# Altium project DAQBOXRev12025.PrjPcb
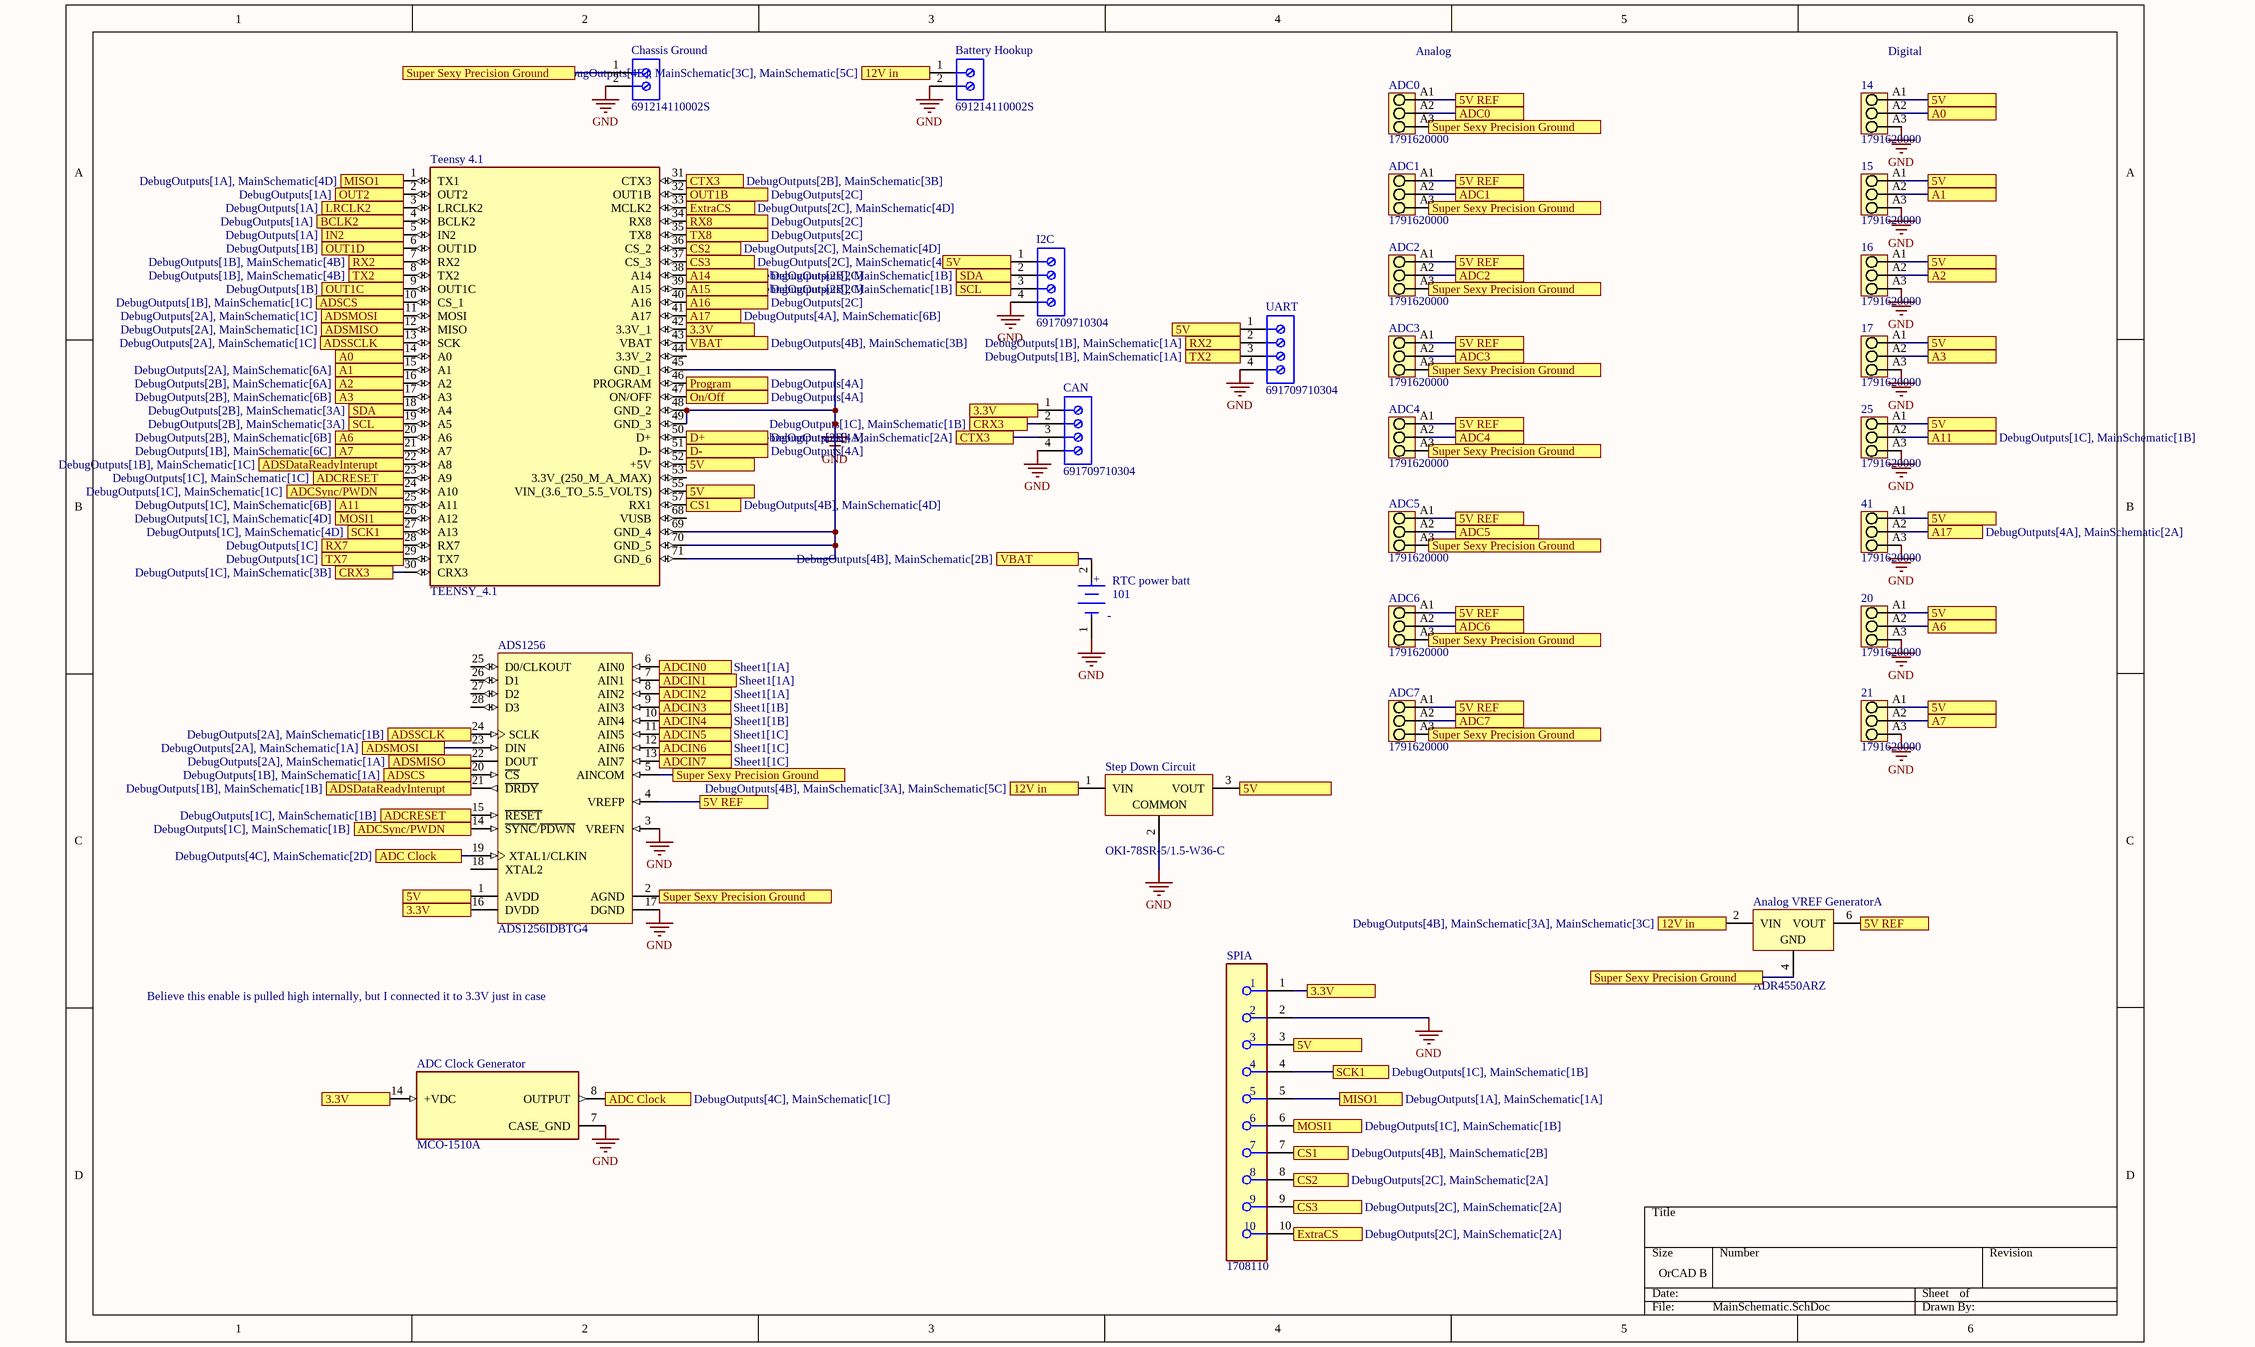
[diagram p0: MainSchematic.SchDoc]
3 sheets, 50 parts. Net scope: flat (ports and power ports of the same name join across sheets).
Board file: PCB2.PcbDoc
Sheets:
  MainSchematic.SchDoc
  DebugOutputs.SchDoc
  Sheet1.SchDoc

## Sheet MainSchematic.SchDoc
size OrCAD B; SheetNumber: 1; SheetTotal: 3

### Parts
14  1791620000  [PM_5_00_90_03]
15  1791620000  [PM_5_00_90_03]
16  1791620000  [PM_5_00_90_03]
17  1791620000  [PM_5_00_90_03]
20  1791620000  [PM_5_00_90_03]
21  1791620000  [PM_5_00_90_03]
25  1791620000  [PM_5_00_90_03]
41  1791620000  [PM_5_00_90_03]
ADC0  1791620000  [PM_5_00_90_03]
ADC1  1791620000  [PM_5_00_90_03]
ADC2  1791620000  [PM_5_00_90_03]
ADC3  1791620000  [PM_5_00_90_03]
ADC4  1791620000  [PM_5_00_90_03]
ADC5  1791620000  [PM_5_00_90_03]
ADC6  1791620000  [PM_5_00_90_03]
ADC7  1791620000  [PM_5_00_90_03]
ADC_Clock_Generator  MCO-1510A  [OSC_ECS-100AX-500]
ADS1256  ADS1256IDBTG4  [TI-DB28_L]
Analog_VREF_Generator  ADR4550ARZ  [ADI-R-8_N]  (part A of 2)
Battery_Hookup  691214110002S  [691214110002S]
CAN  691709710304  [691709710304]
Chassis_Ground  691214110002S  [691214110002S]
I2C  691709710304  [691709710304]
RTC_power_batt  101  [FP-101-MFG]
SPI  1708110  [FP-1708110-MFG]  (part A of 2)
Step_Down_Circuit  OKI-78SR-5/1.5-W36-C  [MURA-OKI-78SR-3]
Teensy_4.1  TEENSY_4.1  [TEENSY41]
UART  691709710304  [691709710304]

### Ports
3.3V (see DebugOutputs[4B], MainSchematic[1C], MainSchematic[1D], MainSchematic[2A], MainSchematic[3B]), 3.3V (see DebugOutputs[4B], MainSchematic[1C], MainSchematic[1D], MainSchematic[2A], MainSchematic[4C]), 3.3V (see DebugOutputs[4B], MainSchematic[1C], MainSchematic[1D], MainSchematic[3B], MainSchematic[4C]), 3.3V (see DebugOutputs[4B], MainSchematic[1C], MainSchematic[2A], MainSchematic[3B], MainSchematic[4C]), 3.3V (see DebugOutputs[4B], MainSchematic[1D], MainSchematic[2A], MainSchematic[3B], MainSchematic[4C]), 5V (see DebugOutputs[4B], MainSchematic[1C], MainSchematic[2B], MainSchematic[3A], MainSchematic[4A], MainSchematic[4C], MainSchematic[4D], MainSchematic[6A], MainSchematic[6B]), 5V (see DebugOutputs[4B], MainSchematic[1C], MainSchematic[2B], MainSchematic[3A], MainSchematic[4A], MainSchematic[4C], MainSchematic[4D], MainSchematic[6A], MainSchematic[6B], MainSchematic[6C]), 5V (see DebugOutputs[4B], MainSchematic[1C], MainSchematic[2B], MainSchematic[3A], MainSchematic[4A], MainSchematic[4C], MainSchematic[6A], MainSchematic[6B], MainSchematic[6C]), 5V (see DebugOutputs[4B], MainSchematic[1C], MainSchematic[2B], MainSchematic[3A], MainSchematic[4A], MainSchematic[4D], MainSchematic[6A], MainSchematic[6B], MainSchematic[6C]), 5V (see DebugOutputs[4B], MainSchematic[1C], MainSchematic[2B], MainSchematic[3A], MainSchematic[4C], MainSchematic[4D], MainSchematic[6A], MainSchematic[6B], MainSchematic[6C]), 5V (see DebugOutputs[4B], MainSchematic[1C], MainSchematic[2B], MainSchematic[4A], MainSchematic[4C], MainSchematic[4D], MainSchematic[6A], MainSchematic[6B], MainSchematic[6C]), 5V (see DebugOutputs[4B], MainSchematic[2B], MainSchematic[3A], MainSchematic[4A], MainSchematic[4C], MainSchematic[4D], MainSchematic[6A], MainSchematic[6B], MainSchematic[6C]), 5V REF (see DebugOutputs[4B], MainSchematic[2C], MainSchematic[5A], MainSchematic[5B], MainSchematic[5C]), 5V REF (see DebugOutputs[4B], MainSchematic[2C], MainSchematic[5A], MainSchematic[5B], MainSchematic[5C], MainSchematic[6C]), 5V REF (see DebugOutputs[4B], MainSchematic[2C], MainSchematic[5A], MainSchematic[5B], MainSchematic[6C]), 5V REF (see DebugOutputs[4B], MainSchematic[5A], MainSchematic[5B], MainSchematic[5C], MainSchematic[6C]), 12V in (see DebugOutputs[4B], MainSchematic[3A], MainSchematic[3C]), 12V in (see DebugOutputs[4B], MainSchematic[3A], MainSchematic[5C]), 12V in (see DebugOutputs[4B], MainSchematic[3C], MainSchematic[5C]), A0 (see DebugOutputs[2A], MainSchematic[1B]), A0 (see DebugOutputs[2A], MainSchematic[6A]), A1 (see DebugOutputs[2A], MainSchematic[1B]), A1 (see DebugOutputs[2A], MainSchematic[6A]), A2 (see DebugOutputs[2B], MainSchematic[1B]), A2 (see DebugOutputs[2B], MainSchematic[6A]), A3 (see DebugOutputs[2B], MainSchematic[1B]), A3 (see DebugOutputs[2B], MainSchematic[6B]), A6 (see DebugOutputs[2B], MainSchematic[1B]), A6 (see DebugOutputs[2B], MainSchematic[6B]), A7 (see DebugOutputs[1B], MainSchematic[1B]), A7 (see DebugOutputs[1B], MainSchematic[6C]), A11 (see DebugOutputs[1C], MainSchematic[1B]), A11 (see DebugOutputs[1C], MainSchematic[6B]), A14 (see DebugOutputs[2C]), A15 (see DebugOutputs[2C]), A16 (see DebugOutputs[2C]), A17 (see DebugOutputs[4A], MainSchematic[2A]), A17 (see DebugOutputs[4A], MainSchematic[6B]), ADC0 (see DebugOutputs[4C], Sheet1[2A]), ADC1 (see DebugOutputs[4C], Sheet1[2A]), ADC2 (see DebugOutputs[4C], Sheet1[2A]), ADC3 (see DebugOutputs[4C], Sheet1[2B]), ADC4 (see DebugOutputs[4C], Sheet1[2B]), ADC5 (see DebugOutputs[4C], Sheet1[2C]), ADC6 (see DebugOutputs[4C], Sheet1[2C]), ADC7 (see DebugOutputs[4C], Sheet1[2C]), ADC Clock (see DebugOutputs[4C], MainSchematic[1C]), ADC Clock (see DebugOutputs[4C], MainSchematic[2D]), ADCIN0 (see Sheet1[1A]), ADCIN1 (see Sheet1[1A]), ADCIN2 (see Sheet1[1A]), ADCIN3 (see Sheet1[1B]), ADCIN4 (see Sheet1[1B]), ADCIN5 (see Sheet1[1C]), ADCIN6 (see Sheet1[1C]), ADCIN7 (see Sheet1[1C]), ADCRESET (see DebugOutputs[1C], MainSchematic[1B]), ADCRESET (see DebugOutputs[1C], MainSchematic[1C]), ADCSync/PWDN (see DebugOutputs[1C], MainSchematic[1B]), ADCSync/PWDN (see DebugOutputs[1C], MainSchematic[1C]), ADSCS (see DebugOutputs[1B], MainSchematic[1A]), ADSCS (see DebugOutputs[1B], MainSchematic[1C]), ADSDataReadyInterupt (see DebugOutputs[1B], MainSchematic[1B]), ADSDataReadyInterupt (see DebugOutputs[1B], MainSchematic[1C]), ADSMISO (see DebugOutputs[2A], MainSchematic[1A]), ADSMISO (see DebugOutputs[2A], MainSchematic[1C]), ADSMOSI (see DebugOutputs[2A], MainSchematic[1A]), ADSMOSI (see DebugOutputs[2A], MainSchematic[1C]), ADSSCLK (see DebugOutputs[2A], MainSchematic[1B]), ADSSCLK (see DebugOutputs[2A], MainSchematic[1C]), BCLK2 (see DebugOutputs[1A]), CRX3 (see DebugOutputs[1C], MainSchematic[1B]), CRX3 (see DebugOutputs[1C], MainSchematic[3B]), CS1 (see DebugOutputs[4B], MainSchematic[2B]), CS1 (see DebugOutputs[4B], MainSchematic[4D]), CS2 (see DebugOutputs[2C], MainSchematic[2A]), CS2 (see DebugOutputs[2C], MainSchematic[4D]), CS3 (see DebugOutputs[2C], MainSchematic[2A]), CS3 (see DebugOutputs[2C], MainSchematic[4D]), CTX3 (see DebugOutputs[2B], MainSchematic[2A]), CTX3 (see DebugOutputs[2B], MainSchematic[3B]), D+ (see DebugOutputs[4A]), D- (see DebugOutputs[4A]), ExtraCS (see DebugOutputs[2C], MainSchematic[2A]), ExtraCS (see DebugOutputs[2C], MainSchematic[4D]), IN2 (see DebugOutputs[1A]), LRCLK2 (see DebugOutputs[1A]), MISO1 (see DebugOutputs[1A], MainSchematic[1A]), MISO1 (see DebugOutputs[1A], MainSchematic[4D]), MOSI1 (see DebugOutputs[1C], MainSchematic[1B]), MOSI1 (see DebugOutputs[1C], MainSchematic[4D]), On/Off (see DebugOutputs[4A]), OUT1B (see DebugOutputs[2C]), OUT1C (see DebugOutputs[1B]), OUT1D (see DebugOutputs[1B]), OUT2 (see DebugOutputs[1A]), Program (see DebugOutputs[4A]), RX2 (see DebugOutputs[1B], MainSchematic[1A]), RX2 (see DebugOutputs[1B], MainSchematic[4B]), RX7 (see DebugOutputs[1C]), RX8 (see DebugOutputs[2C]), SCK1 (see DebugOutputs[1C], MainSchematic[1B]), SCK1 (see DebugOutputs[1C], MainSchematic[4D]), SCL (see DebugOutputs[2B], MainSchematic[1B]), SCL (see DebugOutputs[2B], MainSchematic[3A]), SDA (see DebugOutputs[2B], MainSchematic[1B]), SDA (see DebugOutputs[2B], MainSchematic[3A]), Super Sexy Precision Ground (see MainSchematic[1A], MainSchematic[2C], MainSchematic[4A], MainSchematic[4B], MainSchematic[4C], MainSchematic[5C], Sheet1[1A], Sheet1[1B], Sheet1[1C]), Super Sexy Precision Ground (see MainSchematic[1A], MainSchematic[2C], MainSchematic[4A], MainSchematic[4B], MainSchematic[4C], Sheet1[1A], Sheet1[1B], Sheet1[1C]), Super Sexy Precision Ground (see MainSchematic[1A], MainSchematic[2C], MainSchematic[4A], MainSchematic[4B], MainSchematic[5C], Sheet1[1A], Sheet1[1B], Sheet1[1C]), Super Sexy Precision Ground (see MainSchematic[2C], MainSchematic[4A], MainSchematic[4B], MainSchematic[4C], MainSchematic[5C], Sheet1[1A], Sheet1[1B], Sheet1[1C]), TX2 (see DebugOutputs[1B], MainSchematic[1A]), TX2 (see DebugOutputs[1B], MainSchematic[4B]), TX7 (see DebugOutputs[1C]), TX8 (see DebugOutputs[2C]), VBAT (see DebugOutputs[4B], MainSchematic[2B]), VBAT (see DebugOutputs[4B], MainSchematic[3B])

### Nets
GND: 14.A3 15.A3 16.A3 17.A3 20.A3 21.A3 25.A3 41.A3 ADC_Clock_Generator.7(CASE_GND) ADS1256.3(VREFN) ADS1256.17(DGND) Battery_Hookup.2 CAN.4 Chassis_Ground.2 I2C.4 RTC_power_batt.1(C) SPI.2 Step_Down_Circuit.2(COMMON) Teensy_4.1.45(GND_1) Teensy_4.1.48(GND_2) Teensy_4.1.49(GND_3) Teensy_4.1.69(GND_4) Teensy_4.1.70(GND_5) Teensy_4.1.71(GND_6) UART.4
Net14_A1: 14.A1 15.A1 16.A1 17.A1 20.A1 21.A1 25.A1 41.A1 ADS1256.1(AVDD) I2C.1 SPI.3 Step_Down_Circuit.3(VOUT) Teensy_4.1.52(+5V) Teensy_4.1.55(VIN_(3.6_TO_5.5_VOLTS)) UART.1 ; port 5V
Net14_A2: 14.A2 Teensy_4.1.14(A0) ; port A0
Net15_A2: 15.A2 Teensy_4.1.15(A1) ; port A1
Net16_A2: 16.A2 Teensy_4.1.16(A2) ; port A2
Net17_A2: 17.A2 Teensy_4.1.17(A3) ; port A3
Net20_A2: 20.A2 Teensy_4.1.20(A6) ; port A6
Net21_A2: 21.A2 Teensy_4.1.21(A7) ; port A7
Net25_A2: 25.A2 Teensy_4.1.25(A11) ; port A11
Net41_A2: 41.A2 Teensy_4.1.41(A17) ; port A17
NetADC0_A1: ADC0.A1 ADC1.A1 ADC2.A1 ADC3.A1 ADC4.A1 ADC5.A1 ADC6.A1 ADC7.A1 ADS1256.4(VREFP) Analog_VREF_Generator.6(VOUT) ; port 5V REF
NetADC0_A2: ADC0.A2 ; port ADC0
NetADC0_A3: ADC0.A3 ADC1.A3 ADC2.A3 ADC3.A3 ADC4.A3 ADC5.A3 ADC6.A3 ADC7.A3 ADS1256.2(AGND) ADS1256.5(AINCOM) Analog_VREF_Generator.4(GND) Chassis_Ground.1 ; port Super Sexy Precision Ground
NetADC1_A2: ADC1.A2 ; port ADC1
NetADC2_A2: ADC2.A2 ; port ADC2
NetADC3_A2: ADC3.A2 ; port ADC3
NetADC4_A2: ADC4.A2 ; port ADC4
NetADC5_A2: ADC5.A2 ; port ADC5
NetADC6_A2: ADC6.A2 ; port ADC6
NetADC7_A2: ADC7.A2 ; port ADC7
NetADC_Clock_Generator_8: ADC_Clock_Generator.8(OUTPUT) ADS1256.19(XTAL1/CLKIN) ; port ADC Clock
NetADC_Clock_Generator_14: ADC_Clock_Generator.14(+VDC) ADS1256.16(DVDD) CAN.1 SPI.1 Teensy_4.1.42(3.3V_1) ; port 3.3V
NetADS1256_6: ADS1256.6(AIN0) ; port ADCIN0
NetADS1256_7: ADS1256.7(AIN1) ; port ADCIN1
NetADS1256_8: ADS1256.8(AIN2) ; port ADCIN2
NetADS1256_9: ADS1256.9(AIN3) ; port ADCIN3
NetADS1256_10: ADS1256.10(AIN4) ; port ADCIN4
NetADS1256_11: ADS1256.11(AIN5) ; port ADCIN5
NetADS1256_12: ADS1256.12(AIN6) ; port ADCIN6
NetADS1256_13: ADS1256.13(AIN7) ; port ADCIN7
NetADS1256_14: ADS1256.14(~{SYNC}/~{PDWN}) Teensy_4.1.24(A10) ; port ADCSync/PWDN
NetADS1256_15: ADS1256.15(~{RESET}) Teensy_4.1.23(A9) ; port ADCRESET
NetADS1256_20: ADS1256.20(~{CS}) Teensy_4.1.10(CS_1) ; port ADSCS
NetADS1256_21: ADS1256.21(~{DRDY}) Teensy_4.1.22(A8) ; port ADSDataReadyInterupt
NetADS1256_22: ADS1256.22(DOUT) Teensy_4.1.12(MISO) ; port ADSMISO
NetADS1256_23: ADS1256.23(DIN) Teensy_4.1.11(MOSI) ; port ADSMOSI
NetADS1256_24: ADS1256.24(SCLK) Teensy_4.1.13(SCK) ; port ADSSCLK
NetAnalog_VREF_Generator_2: Analog_VREF_Generator.2(VIN) Battery_Hookup.1 Step_Down_Circuit.1(VIN) ; port 12V in
NetCAN_2: CAN.2 Teensy_4.1.30(CRX3) ; port CRX3
NetCAN_3: CAN.3 Teensy_4.1.31(CTX3) ; port CTX3
NetDBG1_1: SPI.5 Teensy_4.1.1(TX1) ; port MISO1
NetDBG1_3: Teensy_4.1.2(OUT2) ; port OUT2
NetDBG1_5: Teensy_4.1.3(LRCLK2) ; port LRCLK2
NetDBG1_7: Teensy_4.1.4(BCLK2) ; port BCLK2
NetDBG1_9: Teensy_4.1.5(IN2) ; port IN2
NetDBG1_11: Teensy_4.1.6(OUT1D) ; port OUT1D
NetDBG1_13: Teensy_4.1.7(RX2) UART.2 ; port RX2
NetDBG1_15: Teensy_4.1.8(TX2) UART.3 ; port TX2
NetDBG1_17: Teensy_4.1.9(OUT1C) ; port OUT1C
NetDBG2_15: I2C.2 Teensy_4.1.18(A4) ; port SDA
NetDBG2_17: I2C.3 Teensy_4.1.19(A5) ; port SCL
NetDBG3_11: SPI.6 Teensy_4.1.26(A12) ; port MOSI1
NetDBG3_13: SPI.4 Teensy_4.1.27(A13) ; port SCK1
NetDBG3_15: Teensy_4.1.28(RX7) ; port RX7
NetDBG3_17: Teensy_4.1.29(TX7) ; port TX7
NetDBG4_3: Teensy_4.1.32(OUT1B) ; port OUT1B
NetDBG4_5: SPI.10 Teensy_4.1.33(MCLK2) ; port ExtraCS
NetDBG4_7: Teensy_4.1.34(RX8) ; port RX8
NetDBG4_9: Teensy_4.1.35(TX8) ; port TX8
NetDBG4_11: SPI.8 Teensy_4.1.36(CS_2) ; port CS2
NetDBG4_13: SPI.9 Teensy_4.1.37(CS_3) ; port CS3
NetDBG4_15: Teensy_4.1.38(A14) ; port A14
NetDBG4_17: Teensy_4.1.39(A15) ; port A15
NetDBG4_19: Teensy_4.1.40(A16) ; port A16
NetDBG5_3: Teensy_4.1.46(PROGRAM) ; port Program
NetDBG5_5: Teensy_4.1.47(ON/OFF) ; port On/Off
NetDBG5_7: Teensy_4.1.50(D+) ; port D+
NetDBG5_9: Teensy_4.1.51(D-) ; port D-
NetDBG5_11: SPI.7 Teensy_4.1.57(RX1) ; port CS1
NetDBG5_15: RTC_power_batt.2(A) Teensy_4.1.43(VBAT) ; port VBAT

Not connected (* = marked no-connect by the designer): ADS1256 18(XTAL2) 25(D0/CLKOUT) 26(D1) 27(D2) 28(D3); Teensy_4.1 44(3.3V_2) 53(3.3V_(250_M_A_MAX)) 68(VUSB)

### Notes on the sheet
- (near ADC0) Analog
- (near 14) Digital
- Believe this enable is pulled high internally, but I connected it to 3.3V just in case
- (in symbol CMP-19636-000018-1) +

### Library data of the parts
14-17 20 21 25 41 ADC0-ADC7 = CMP-1559-01624-1: OMNIMATE Signal - series PM; Manufacturer: Weidmueller; Mounting_onto_the_PCB: Solder connection; Pitch_mm: 5 mm; Solder_pin_length_mm: 3,5 mm; Solid_max_H05_07_V_U: 2,5 mm²; Wire_cross_section_AWG_max_UL_1059: AWG 14; Rated_voltage_use_group_B_UL_1059: 300 V; Pitch_inch: 0,197 inch; UL_94_flammability_rating: V-0; Insulating_material: Wemid (PA); No_of_poles: 3; Solid_min_H05_07_V_U: 0,13 mm²; Contact_material: Cu-Leg; Short_text_for_material: PM 5.00/03/90 3.5SN OR BX; Rated_voltage_for_surge_voltage_class_pollution_degree_II_2: 600 V; Side_termination_characteristic: closed side; Wire_cross_section_AWG_min_UL_1059: AWG 26; Contact_surface: tinned; Rated_current_use_group_B_UL_1059: 15 A; ComponentLink2Description: URL Link1; Revision: V1; Colour: Orange; ComponentLink1URL: http://www.weidmueller.com/; Packaging: Box; Qty: 500 PCS; PackageReference: PM_5_00_90_03; PartNumber: 1791620000; ComponentLink2URL: http://catalog.weidmueller.com/catalog/Start.do?localeId=en&ObjectID=1791620000; ComponentLink1Description: Manufacturer URL
ADC_Clock_Generator = ECS-100AX-500: Oscillator  14-DIP, 4 Leads (Full Size, Metal Can); Package: None; Price: None; Value: *; MP: ECS-100AX-500; Availability: Unavailable
ADS1256 = CMP-0003-00153-1: 24-Bit, 30 kSPS Very Low Noise Delta-Sigma ADC with Multiplexer, -40 to 85 degC, 28-pin SOP (DB28), Green (RoHS & no Sb/Br); Manufacturer: Texas Instruments; SubFamily: Precision ADC (<=10MSPS); Analog Voltage AV/DD(Min)(V): 4.75; Digital Supply(Max)(V): 3.6; Digital Supply(Min)(V): 1.8; Resolution(Bits): 24; Analog Voltage AV/DD(Max)(V): 5.25; Sample Rate (max)(SPS): 30k; # Input Channels: 8; Interface: Serial SPI; Mounting Technology: Surface Mount; Architecture: Delta-Sigma; DatasheetVersion: SBAS288J; ComponentLink3Description: Package Specification; Eco-Plan: Green (RoHS & no Sb/Br); Code_JEDEC: MO-150; PackageDescription: 28-Pin Plastic Small Outline, Body 10.2 X 5.3 mm, Pitch 0.65 mm; ComponentLink3URL: http://www.ti.com/lit/ml/msso002e/msso002e.pdf; ComponentLink1Description: Manufacturer URL; ComponentLink1URL: http://www.ti.com/; PartNumber: ADS1256IDBTG4; ComponentLink2URL: http://www.ti.com/general/docs/lit/getliterature.tsp?genericPartNumber=ADS1256&fileType=pdf; PackageReference: DB28; PackageVersion: 4040065/E, 12/2001; ComponentLink2Description: Datasheet
Analog_VREF_Generator = CMP-0784-00194-1: Ultralow Noise, High Accuracy Voltage Reference, 5 V Output, 3 to 15 V Supply, Industrial, 8-pin SOIC (R-8), Tube; Manufacturer: Analog Devices; Vout: 5V; Max V Supply (V): 15; Min V Supply (V): 3; Ref Out TC (ppm/C): 4; PackageReference: R-8; PackageDescription: 8-Pin Standard Small Outline Package, Body 4.9 x 3.9 mm, Pitch 1.27 mm; PackageVersion: 060506-A, 06/2006; Operating Temp Range: -40 to 125 degC; DatasheetVersion: Rev. 0; ComponentLink1URL: http://www.analog.com/en/index.html; PartNumber: ADR4550ARZ; Mounting Technology: Surface Mount; ComponentLink2URL: http://www.analog.com/static/imported-files/data_sheets/ADR4520_4525_4530_4533_4540_4550.pdf; ComponentLink2Description: Datasheet; ComponentLink3Description: Package Specification; ComponentLink3URL: http://www.analog.com/static/imported-files/packages/PKG_PDF/SOIC_Narrow%20(R)/R_8.pdf; Packing: Tube; ComponentLink1Description: Manufacturer URL; Code_JEDEC: MS-012-AA; ComponentLink4Description: URL Link1; ComponentLink4URL: Product URL:http://www.analog.com/en/special-linear-functions/voltage-references/adr4550/products/product.html
Battery_Hookup Chassis_Ground = CMP-1502-02465-2: NexarPartId: 94172715; Voltage Rating: 300V; Number of Contacts: 2; Current Rating: 10A; Lead Pitch: 3.5mm; Height: 9.2mm; Min Operating Temperature: -30°C; Number of Pins: 2; Packaging: Box; Max Operating Temperature: 120°C; Contact Material: Nickel, Tin; Number of Rows: 1
CAN I2C UART = CMP-1502-03337-2: NexarPartId: 34171771; Current: 6A; Voltage: 300V; Number of Positions Per Level: 4; Plating: Steel; Wire Gauge (Max): 30AWG; Pitch: 5mm; Connector Type: Screw; Number of Levels: 1; Color: Black; Lead Pitch: 5mm; Mount: Surface Mount; Flammability Rating: UL94 V-0; Termination: Screw; Housing Material: Nylon; Min Operating Temperature: -40°C; REACH SVHC: Unknown; Number of Pins: 4; Contact Plating: Tin; Packaging: Digi-Reel®; Height: 10.2mm; Number of Rows: 1; Number of Positions: 4; Contact Material: Nickel; Current Rating: 6A; Wire Gauge (Min): 30AWG; Voltage Rating: 300V; Length: 20mm; Wire/Cable Gauge: 30AWG; RoHS: Compliant; Number of Contacts: 4; Max Operating Temperature: 130°C
RTC_power_batt = CMP-19636-000018-1: BATTERY HOLDER COIN 20MM PC PIN; Body Material: PBT; Number of Batteries: 1; Packaging: Bag; Lead Free: Lead Free; Package Quantity: 1; Contact Plating: Tin; Termination: PC Pin; REACH SVHC: No SVHC; Material: Steel; Mount: Through Hole; Max Operating Temperature: 145°C; Min Operating Temperature: -50°C; Number of Cells: 1; Series: -
SPI = CMP-00298-00058710-1: 1708110 10 Position Wire to Board Terminal Block Horizontal with Board 0.150" (3.81mm) Through Hole; NexarPartId: 58710; Number of Circuits: 20; Max Current Rating: 10A; Gender: Male; Stripping Length: 5mm; Connector Type: Screw; Voltage: 300V; Number of Poles: 10; Wire Gauge (Min): 26AWG; Wire Gauge (Max): 30AWG; Current Rating: 8A; Number of Levels: 2; Voltage Rating: 200V; Approvals: CB, CSA, UL, cULus; Width: 16.3mm; Ambient Temperature Range High: 105°C; Depth: 16.2mm; Min Operating Temperature: -40°C; Number of Rows: 2; Contact Material: Tin; Termination: Screw; Mount: Through Hole; Housing Color: Green; RoHS: Compliant; Pitch: 3.81mm; Color: Green; Housing Material: Nylon; Insulation Material: Nylon; Number of Contacts: 10; Current: 10A; Max Operating Temperature: 105°C; Number of Positions Per Level: 10; Flammability Rating: UL94 V-0; Length: 38.1mm; Material: Polyamide; Number of Positions: 10; Lead Free: Lead Free; Weight: 1.360777kg; Height: 16.2mm; Number of Pins: 20; Orientation: Straight
Step_Down_Circuit = CMP-2000-05274-1: Non-Isolated DC/DC Converter, 7.5 W, 7 to 36 V, 1.5 A, -40 to 85 degC, 3-Pin THD, RoHS; Manufacturer: Murata; Current - Output (Max): 1.5A; Power (Watts) - Max: 8W; Efficiency: 90.5%; Voltage - Input (Min): 7V; Voltage - Input (Max): 36V; Voltage - Output 1: 5V; Number of Outputs: 1; Package / Case: 3-SIPModule; Features: SCP; Type: LinearRegulatorReplacement; Size / Dimension: 0.41"Lx0.30"Wx0.65"H(10.4mmx7.6mmx16.5mm); Datasheet URL: https://datasheet.ciiva.com/8006/1790439-8006672.pdf; Datasheet Version: Oct-13; Power (Watts) - Manufacture Series: 8W; Voltage - Output 2: -; Series: Okami™OKI-78SR; Family: DCDCConverters; Manufacturer URL: http://www.murata.com/; Category: PowerSupplies-BoardMount; Voltage - Isolation: -; Packaging: Tube; Applications: ITE(Commercial); Mounting Type: ThroughHole; Voltage - Output 3: -; Operating Temperature: -40degC~85degC
Teensy_4.1 = TEENSY_4.1: <b>Teensy 4.1 Development Board</b><p> Source: <a href="https://www.pjrc.com/store/teensy41.html"> Datasheet </a>; MF: PJRC; SnapEDA_Link: https://www.snapeda.com/parts/Teensy%204.1/PJRC/view-part/?ref=snap; Package: None; Value: *; MP: Teensy 4.1; Check_prices: https://www.snapeda.com/parts/Teensy%204.1/PJRC/view-part/?ref=eda

## Sheet DebugOutputs.SchDoc
size OrCAD A; SheetNumber: 2; SheetTotal: 3
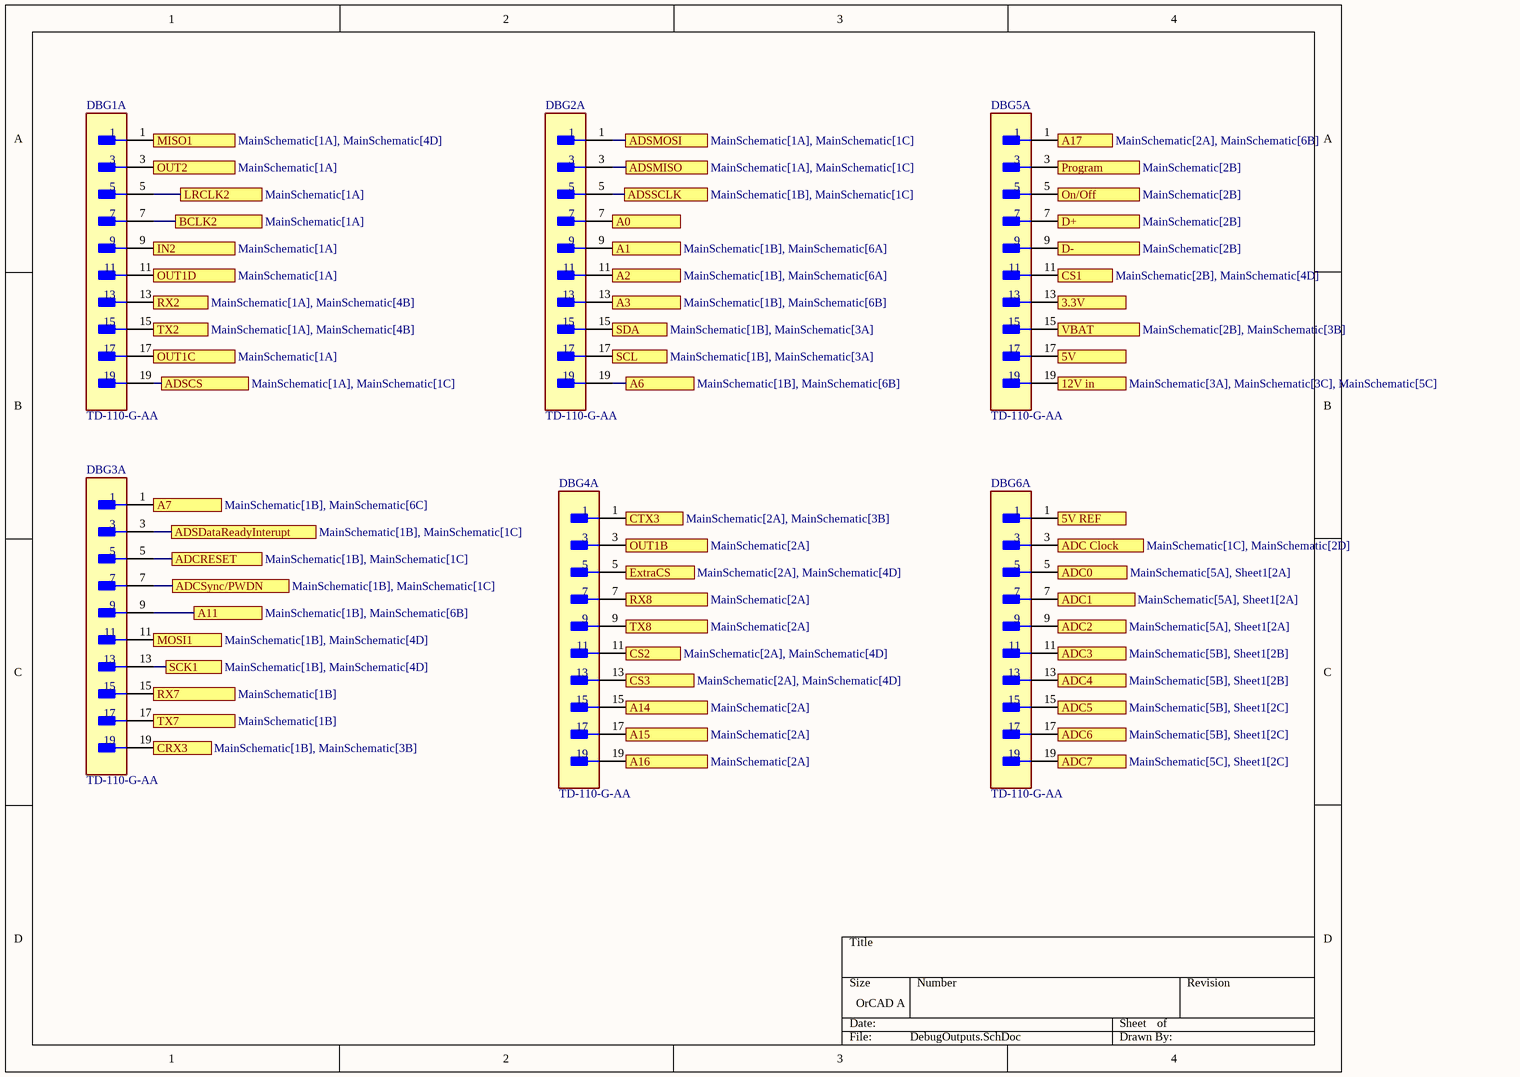
[diagram p1: DebugOutputs.SchDoc]

### Parts
DBG1  TD-110-G-AA  [FP-TD-110-G-AA-MFG]  (part A of 2)
DBG2  TD-110-G-AA  [FP-TD-110-G-AA-MFG]  (part A of 2)
DBG3  TD-110-G-AA  [FP-TD-110-G-AA-MFG]  (part A of 2)
DBG4  TD-110-G-AA  [FP-TD-110-G-AA-MFG]  (part A of 2)
DBG5  TD-110-G-AA  [FP-TD-110-G-AA-MFG]  (part A of 2)
DBG6  TD-110-G-AA  [FP-TD-110-G-AA-MFG]  (part A of 2)

### Ports
3.3V (see MainSchematic[1C], MainSchematic[1D], MainSchematic[2A], MainSchematic[3B], MainSchematic[4C]), 5V (see MainSchematic[1C], MainSchematic[2B], MainSchematic[3A], MainSchematic[4A], MainSchematic[4C], MainSchematic[4D], MainSchematic[6A], MainSchematic[6B], MainSchematic[6C]), 5V REF (see MainSchematic[2C], MainSchematic[5A], MainSchematic[5B], MainSchematic[5C], MainSchematic[6C]), 12V in (see MainSchematic[3A], MainSchematic[3C], MainSchematic[5C]), A0 (see MainSchematic[1B], MainSchematic[6A]), A1 (see MainSchematic[1B], MainSchematic[6A]), A2 (see MainSchematic[1B], MainSchematic[6A]), A3 (see MainSchematic[1B], MainSchematic[6B]), A6 (see MainSchematic[1B], MainSchematic[6B]), A7 (see MainSchematic[1B], MainSchematic[6C]), A11 (see MainSchematic[1B], MainSchematic[6B]), A14 (see MainSchematic[2A]), A15 (see MainSchematic[2A]), A16 (see MainSchematic[2A]), A17 (see MainSchematic[2A], MainSchematic[6B]), ADC0 (see MainSchematic[5A], Sheet1[2A]), ADC1 (see MainSchematic[5A], Sheet1[2A]), ADC2 (see MainSchematic[5A], Sheet1[2A]), ADC3 (see MainSchematic[5B], Sheet1[2B]), ADC4 (see MainSchematic[5B], Sheet1[2B]), ADC5 (see MainSchematic[5B], Sheet1[2C]), ADC6 (see MainSchematic[5B], Sheet1[2C]), ADC7 (see MainSchematic[5C], Sheet1[2C]), ADC Clock (see MainSchematic[1C], MainSchematic[2D]), ADCRESET (see MainSchematic[1B], MainSchematic[1C]), ADCSync/PWDN (see MainSchematic[1B], MainSchematic[1C]), ADSCS (see MainSchematic[1A], MainSchematic[1C]), ADSDataReadyInterupt (see MainSchematic[1B], MainSchematic[1C]), ADSMISO (see MainSchematic[1A], MainSchematic[1C]), ADSMOSI (see MainSchematic[1A], MainSchematic[1C]), ADSSCLK (see MainSchematic[1B], MainSchematic[1C]), BCLK2 (see MainSchematic[1A]), CRX3 (see MainSchematic[1B], MainSchematic[3B]), CS1 (see MainSchematic[2B], MainSchematic[4D]), CS2 (see MainSchematic[2A], MainSchematic[4D]), CS3 (see MainSchematic[2A], MainSchematic[4D]), CTX3 (see MainSchematic[2A], MainSchematic[3B]), D+ (see MainSchematic[2B]), D- (see MainSchematic[2B]), ExtraCS (see MainSchematic[2A], MainSchematic[4D]), IN2 (see MainSchematic[1A]), LRCLK2 (see MainSchematic[1A]), MISO1 (see MainSchematic[1A], MainSchematic[4D]), MOSI1 (see MainSchematic[1B], MainSchematic[4D]), On/Off (see MainSchematic[2B]), OUT1B (see MainSchematic[2A]), OUT1C (see MainSchematic[1A]), OUT1D (see MainSchematic[1A]), OUT2 (see MainSchematic[1A]), Program (see MainSchematic[2B]), RX2 (see MainSchematic[1A], MainSchematic[4B]), RX7 (see MainSchematic[1B]), RX8 (see MainSchematic[2A]), SCK1 (see MainSchematic[1B], MainSchematic[4D]), SCL (see MainSchematic[1B], MainSchematic[3A]), SDA (see MainSchematic[1B], MainSchematic[3A]), TX2 (see MainSchematic[1A], MainSchematic[4B]), TX7 (see MainSchematic[1B]), TX8 (see MainSchematic[2A]), VBAT (see MainSchematic[2B], MainSchematic[3B])

### Nets
Net14_A1: DBG5.17 ; port 5V
Net14_A2: DBG2.7 ; port A0
Net15_A2: DBG2.9 ; port A1
Net16_A2: DBG2.11 ; port A2
Net17_A2: DBG2.13 ; port A3
Net20_A2: DBG2.19 ; port A6
Net21_A2: DBG3.1 ; port A7
Net25_A2: DBG3.9 ; port A11
Net41_A2: DBG5.1 ; port A17
NetADC0_A1: DBG6.1 ; port 5V REF
NetADC0_A2: DBG6.5 ; port ADC0
NetADC1_A2: DBG6.7 ; port ADC1
NetADC2_A2: DBG6.9 ; port ADC2
NetADC3_A2: DBG6.11 ; port ADC3
NetADC4_A2: DBG6.13 ; port ADC4
NetADC5_A2: DBG6.15 ; port ADC5
NetADC6_A2: DBG6.17 ; port ADC6
NetADC7_A2: DBG6.19 ; port ADC7
NetADC_Clock_Generator_8: DBG6.3 ; port ADC Clock
NetADC_Clock_Generator_14: DBG5.13 ; port 3.3V
NetADS1256_14: DBG3.7 ; port ADCSync/PWDN
NetADS1256_15: DBG3.5 ; port ADCRESET
NetADS1256_20: DBG1.19 ; port ADSCS
NetADS1256_21: DBG3.3 ; port ADSDataReadyInterupt
NetADS1256_22: DBG2.3 ; port ADSMISO
NetADS1256_23: DBG2.1 ; port ADSMOSI
NetADS1256_24: DBG2.5 ; port ADSSCLK
NetAnalog_VREF_Generator_2: DBG5.19 ; port 12V in
NetCAN_2: DBG3.19 ; port CRX3
NetCAN_3: DBG4.1 ; port CTX3
NetDBG1_1: DBG1.1 ; port MISO1
NetDBG1_3: DBG1.3 ; port OUT2
NetDBG1_5: DBG1.5 ; port LRCLK2
NetDBG1_7: DBG1.7 ; port BCLK2
NetDBG1_9: DBG1.9 ; port IN2
NetDBG1_11: DBG1.11 ; port OUT1D
NetDBG1_13: DBG1.13 ; port RX2
NetDBG1_15: DBG1.15 ; port TX2
NetDBG1_17: DBG1.17 ; port OUT1C
NetDBG2_15: DBG2.15 ; port SDA
NetDBG2_17: DBG2.17 ; port SCL
NetDBG3_11: DBG3.11 ; port MOSI1
NetDBG3_13: DBG3.13 ; port SCK1
NetDBG3_15: DBG3.15 ; port RX7
NetDBG3_17: DBG3.17 ; port TX7
NetDBG4_3: DBG4.3 ; port OUT1B
NetDBG4_5: DBG4.5 ; port ExtraCS
NetDBG4_7: DBG4.7 ; port RX8
NetDBG4_9: DBG4.9 ; port TX8
NetDBG4_11: DBG4.11 ; port CS2
NetDBG4_13: DBG4.13 ; port CS3
NetDBG4_15: DBG4.15 ; port A14
NetDBG4_17: DBG4.17 ; port A15
NetDBG4_19: DBG4.19 ; port A16
NetDBG5_3: DBG5.3 ; port Program
NetDBG5_5: DBG5.5 ; port On/Off
NetDBG5_7: DBG5.7 ; port D+
NetDBG5_9: DBG5.9 ; port D-
NetDBG5_11: DBG5.11 ; port CS1
NetDBG5_15: DBG5.15 ; port VBAT

### Library data of the parts
DBG1-DBG6 = CMP-02766-001426-1: .100" DOUBLE ROW SCREW MACHINE T; Gender: Male; Number of Contacts: 20; REACH SVHC: No SVHC; Contact Material: Brass; Termination: Through Hole; Number of Rows: 2; Contact Plating: Gold; Mount: Through Hole; Series: TD

## Sheet Sheet1.SchDoc
size A; SheetNumber: 3; SheetTotal: 3
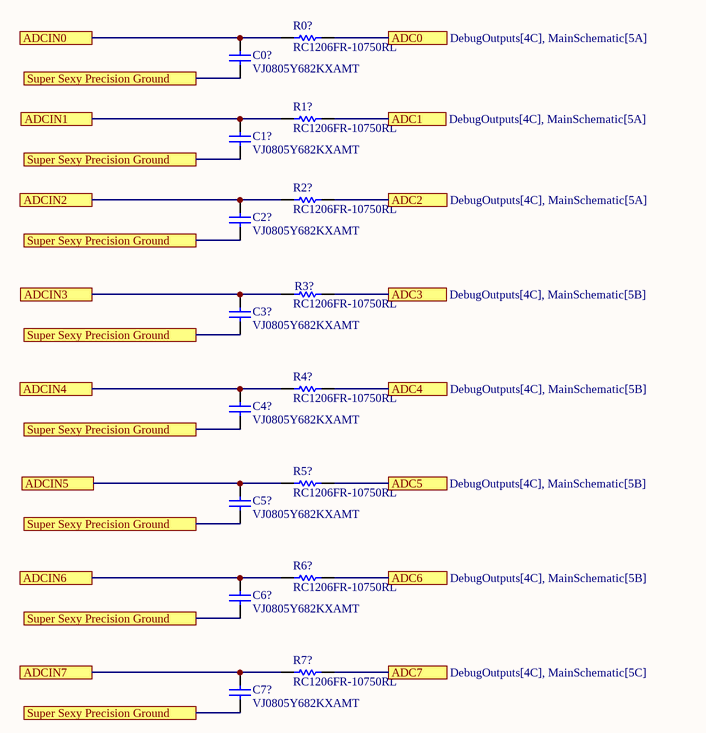
[diagram p2: Sheet1.SchDoc]

### Parts
C0?  VJ0805Y682KXAMT  [CAPC2013X145X48ML20T23]
C1?  VJ0805Y682KXAMT  [CAPC2013X145X48ML20T23]
C2?  VJ0805Y682KXAMT  [CAPC2013X145X48ML20T23]
C3?  VJ0805Y682KXAMT  [CAPC2013X145X48ML20T23]
C4?  VJ0805Y682KXAMT  [CAPC2013X145X48ML20T23]
C5?  VJ0805Y682KXAMT  [CAPC2013X145X48ML20T23]
C6?  VJ0805Y682KXAMT  [CAPC2013X145X48ML20T23]
C7?  VJ0805Y682KXAMT  [CAPC2013X145X48ML20T23]
R0?  RC1206FR-10750RL  [RESC3116X65X40LL10T20]
R1?  RC1206FR-10750RL  [RESC3116X65X40LL10T20]
R2?  RC1206FR-10750RL  [RESC3116X65X40LL10T20]
R3?  RC1206FR-10750RL  [RESC3116X65X40LL10T20]
R4?  RC1206FR-10750RL  [RESC3116X65X40LL10T20]
R5?  RC1206FR-10750RL  [RESC3116X65X40LL10T20]
R6?  RC1206FR-10750RL  [RESC3116X65X40LL10T20]
R7?  RC1206FR-10750RL  [RESC3116X65X40LL10T20]

### Ports
ADC0 (see DebugOutputs[4C], MainSchematic[5A]), ADC1 (see DebugOutputs[4C], MainSchematic[5A]), ADC2 (see DebugOutputs[4C], MainSchematic[5A]), ADC3 (see DebugOutputs[4C], MainSchematic[5B]), ADC4 (see DebugOutputs[4C], MainSchematic[5B]), ADC5 (see DebugOutputs[4C], MainSchematic[5B]), ADC6 (see DebugOutputs[4C], MainSchematic[5B]), ADC7 (see DebugOutputs[4C], MainSchematic[5C]), ADCIN0 (see MainSchematic[2B]), ADCIN1 (see MainSchematic[2C]), ADCIN2 (see MainSchematic[2C]), ADCIN3 (see MainSchematic[2C]), ADCIN4 (see MainSchematic[2C]), ADCIN5 (see MainSchematic[2C]), ADCIN6 (see MainSchematic[2C]), ADCIN7 (see MainSchematic[2C]), Super Sexy Precision Ground (see MainSchematic[1A], MainSchematic[2C], MainSchematic[4A], MainSchematic[4B], MainSchematic[4C], MainSchematic[5C], Sheet1[1A], Sheet1[1B], Sheet1[1C])

### Nets
NetADC0_A2: R0?.2 ; port ADC0
NetADC0_A3: C0?.1 C1?.1 C2?.1 C3?.1 C4?.1 C5?.1 C6?.1 C7?.1 ; port Super Sexy Precision Ground
NetADC1_A2: R1?.2 ; port ADC1
NetADC2_A2: R2?.2 ; port ADC2
NetADC3_A2: R3?.2 ; port ADC3
NetADC4_A2: R4?.2 ; port ADC4
NetADC5_A2: R5?.2 ; port ADC5
NetADC6_A2: R6?.2 ; port ADC6
NetADC7_A2: R7?.2 ; port ADC7
NetADS1256_6: C0?.2 R0?.1 ; port ADCIN0
NetADS1256_7: C1?.2 R1?.1 ; port ADCIN1
NetADS1256_8: C2?.2 R2?.1 ; port ADCIN2
NetADS1256_9: C3?.2 R3?.1 ; port ADCIN3
NetADS1256_10: C4?.2 R4?.1 ; port ADCIN4
NetADS1256_11: C5?.2 R5?.1 ; port ADCIN5
NetADS1256_12: C6?.2 R6?.1 ; port ADCIN6
NetADS1256_13: C7?.2 R7?.1 ; port ADCIN7

### Library data of the parts
C0? C1? C2? C3? C4? C5? C6? C7? = CMP-2007-03205-1: Manufacturer: Vitramon; Part Number: VJ0805Y682KXAMT
R0? R1? R2? R3? R4? R5? R6? R7? = CMP-2003-04964-1: Manufacturer: Yageo; Part Number: RC1206FR-10750RL

## Nets that join several sheets
Net14_A1: MainSchematic (15 pins), DebugOutputs (DBG5.17)
Net14_A2: MainSchematic (14.A2 Teensy_4.1.14), DebugOutputs (DBG2.7)
Net15_A2: MainSchematic (15.A2 Teensy_4.1.15), DebugOutputs (DBG2.9)
Net16_A2: MainSchematic (16.A2 Teensy_4.1.16), DebugOutputs (DBG2.11)
Net17_A2: MainSchematic (17.A2 Teensy_4.1.17), DebugOutputs (DBG2.13)
Net20_A2: MainSchematic (20.A2 Teensy_4.1.20), DebugOutputs (DBG2.19)
Net21_A2: MainSchematic (21.A2 Teensy_4.1.21), DebugOutputs (DBG3.1)
Net25_A2: MainSchematic (25.A2 Teensy_4.1.25), DebugOutputs (DBG3.9)
Net41_A2: MainSchematic (41.A2 Teensy_4.1.41), DebugOutputs (DBG5.1)
NetADC0_A1: MainSchematic (10 pins), DebugOutputs (DBG6.1)
NetADC0_A2: MainSchematic (ADC0.A2), DebugOutputs (DBG6.5), Sheet1 (R0?.2)
NetADC0_A3: MainSchematic (12 pins), Sheet1 (8 pins)
NetADC1_A2: MainSchematic (ADC1.A2), DebugOutputs (DBG6.7), Sheet1 (R1?.2)
NetADC2_A2: MainSchematic (ADC2.A2), DebugOutputs (DBG6.9), Sheet1 (R2?.2)
NetADC3_A2: MainSchematic (ADC3.A2), DebugOutputs (DBG6.11), Sheet1 (R3?.2)
NetADC4_A2: MainSchematic (ADC4.A2), DebugOutputs (DBG6.13), Sheet1 (R4?.2)
NetADC5_A2: MainSchematic (ADC5.A2), DebugOutputs (DBG6.15), Sheet1 (R5?.2)
NetADC6_A2: MainSchematic (ADC6.A2), DebugOutputs (DBG6.17), Sheet1 (R6?.2)
NetADC7_A2: MainSchematic (ADC7.A2), DebugOutputs (DBG6.19), Sheet1 (R7?.2)
NetADC_Clock_Generator_8: MainSchematic (ADC_Clock_Generator.8 ADS1256.19), DebugOutputs (DBG6.3)
NetADC_Clock_Generator_14: MainSchematic (5 pins), DebugOutputs (DBG5.13)
NetADS1256_6: MainSchematic (ADS1256.6), Sheet1 (C0?.2 R0?.1)
NetADS1256_7: MainSchematic (ADS1256.7), Sheet1 (C1?.2 R1?.1)
NetADS1256_8: MainSchematic (ADS1256.8), Sheet1 (C2?.2 R2?.1)
NetADS1256_9: MainSchematic (ADS1256.9), Sheet1 (C3?.2 R3?.1)
NetADS1256_10: MainSchematic (ADS1256.10), Sheet1 (C4?.2 R4?.1)
NetADS1256_11: MainSchematic (ADS1256.11), Sheet1 (C5?.2 R5?.1)
NetADS1256_12: MainSchematic (ADS1256.12), Sheet1 (C6?.2 R6?.1)
NetADS1256_13: MainSchematic (ADS1256.13), Sheet1 (C7?.2 R7?.1)
NetADS1256_14: MainSchematic (ADS1256.14 Teensy_4.1.24), DebugOutputs (DBG3.7)
NetADS1256_15: MainSchematic (ADS1256.15 Teensy_4.1.23), DebugOutputs (DBG3.5)
NetADS1256_20: MainSchematic (ADS1256.20 Teensy_4.1.10), DebugOutputs (DBG1.19)
NetADS1256_21: MainSchematic (ADS1256.21 Teensy_4.1.22), DebugOutputs (DBG3.3)
NetADS1256_22: MainSchematic (ADS1256.22 Teensy_4.1.12), DebugOutputs (DBG2.3)
NetADS1256_23: MainSchematic (ADS1256.23 Teensy_4.1.11), DebugOutputs (DBG2.1)
NetADS1256_24: MainSchematic (ADS1256.24 Teensy_4.1.13), DebugOutputs (DBG2.5)
NetAnalog_VREF_Generator_2: MainSchematic (Analog_VREF_Generator.2 Battery_Hookup.1 Step_Down_Circuit.1), DebugOutputs (DBG5.19)
NetCAN_2: MainSchematic (CAN.2 Teensy_4.1.30), DebugOutputs (DBG3.19)
NetCAN_3: MainSchematic (CAN.3 Teensy_4.1.31), DebugOutputs (DBG4.1)
NetDBG1_1: MainSchematic (SPI.5 Teensy_4.1.1), DebugOutputs (DBG1.1)
NetDBG1_3: MainSchematic (Teensy_4.1.2), DebugOutputs (DBG1.3)
NetDBG1_5: MainSchematic (Teensy_4.1.3), DebugOutputs (DBG1.5)
NetDBG1_7: MainSchematic (Teensy_4.1.4), DebugOutputs (DBG1.7)
NetDBG1_9: MainSchematic (Teensy_4.1.5), DebugOutputs (DBG1.9)
NetDBG1_11: MainSchematic (Teensy_4.1.6), DebugOutputs (DBG1.11)
NetDBG1_13: MainSchematic (Teensy_4.1.7 UART.2), DebugOutputs (DBG1.13)
NetDBG1_15: MainSchematic (Teensy_4.1.8 UART.3), DebugOutputs (DBG1.15)
NetDBG1_17: MainSchematic (Teensy_4.1.9), DebugOutputs (DBG1.17)
NetDBG2_15: MainSchematic (I2C.2 Teensy_4.1.18), DebugOutputs (DBG2.15)
NetDBG2_17: MainSchematic (I2C.3 Teensy_4.1.19), DebugOutputs (DBG2.17)
NetDBG3_11: MainSchematic (SPI.6 Teensy_4.1.26), DebugOutputs (DBG3.11)
NetDBG3_13: MainSchematic (SPI.4 Teensy_4.1.27), DebugOutputs (DBG3.13)
NetDBG3_15: MainSchematic (Teensy_4.1.28), DebugOutputs (DBG3.15)
NetDBG3_17: MainSchematic (Teensy_4.1.29), DebugOutputs (DBG3.17)
NetDBG4_3: MainSchematic (Teensy_4.1.32), DebugOutputs (DBG4.3)
NetDBG4_5: MainSchematic (SPI.10 Teensy_4.1.33), DebugOutputs (DBG4.5)
NetDBG4_7: MainSchematic (Teensy_4.1.34), DebugOutputs (DBG4.7)
NetDBG4_9: MainSchematic (Teensy_4.1.35), DebugOutputs (DBG4.9)
NetDBG4_11: MainSchematic (SPI.8 Teensy_4.1.36), DebugOutputs (DBG4.11)
NetDBG4_13: MainSchematic (SPI.9 Teensy_4.1.37), DebugOutputs (DBG4.13)
NetDBG4_15: MainSchematic (Teensy_4.1.38), DebugOutputs (DBG4.15)
NetDBG4_17: MainSchematic (Teensy_4.1.39), DebugOutputs (DBG4.17)
NetDBG4_19: MainSchematic (Teensy_4.1.40), DebugOutputs (DBG4.19)
NetDBG5_3: MainSchematic (Teensy_4.1.46), DebugOutputs (DBG5.3)
NetDBG5_5: MainSchematic (Teensy_4.1.47), DebugOutputs (DBG5.5)
NetDBG5_7: MainSchematic (Teensy_4.1.50), DebugOutputs (DBG5.7)
NetDBG5_9: MainSchematic (Teensy_4.1.51), DebugOutputs (DBG5.9)
NetDBG5_11: MainSchematic (SPI.7 Teensy_4.1.57), DebugOutputs (DBG5.11)
NetDBG5_15: MainSchematic (RTC_power_batt.2 Teensy_4.1.43), DebugOutputs (DBG5.15)